# Altium schematic sheet VCU-S02-V00-12VProtection.SchDoc
size A4; SheetNumber: 6; SheetTotal: 9
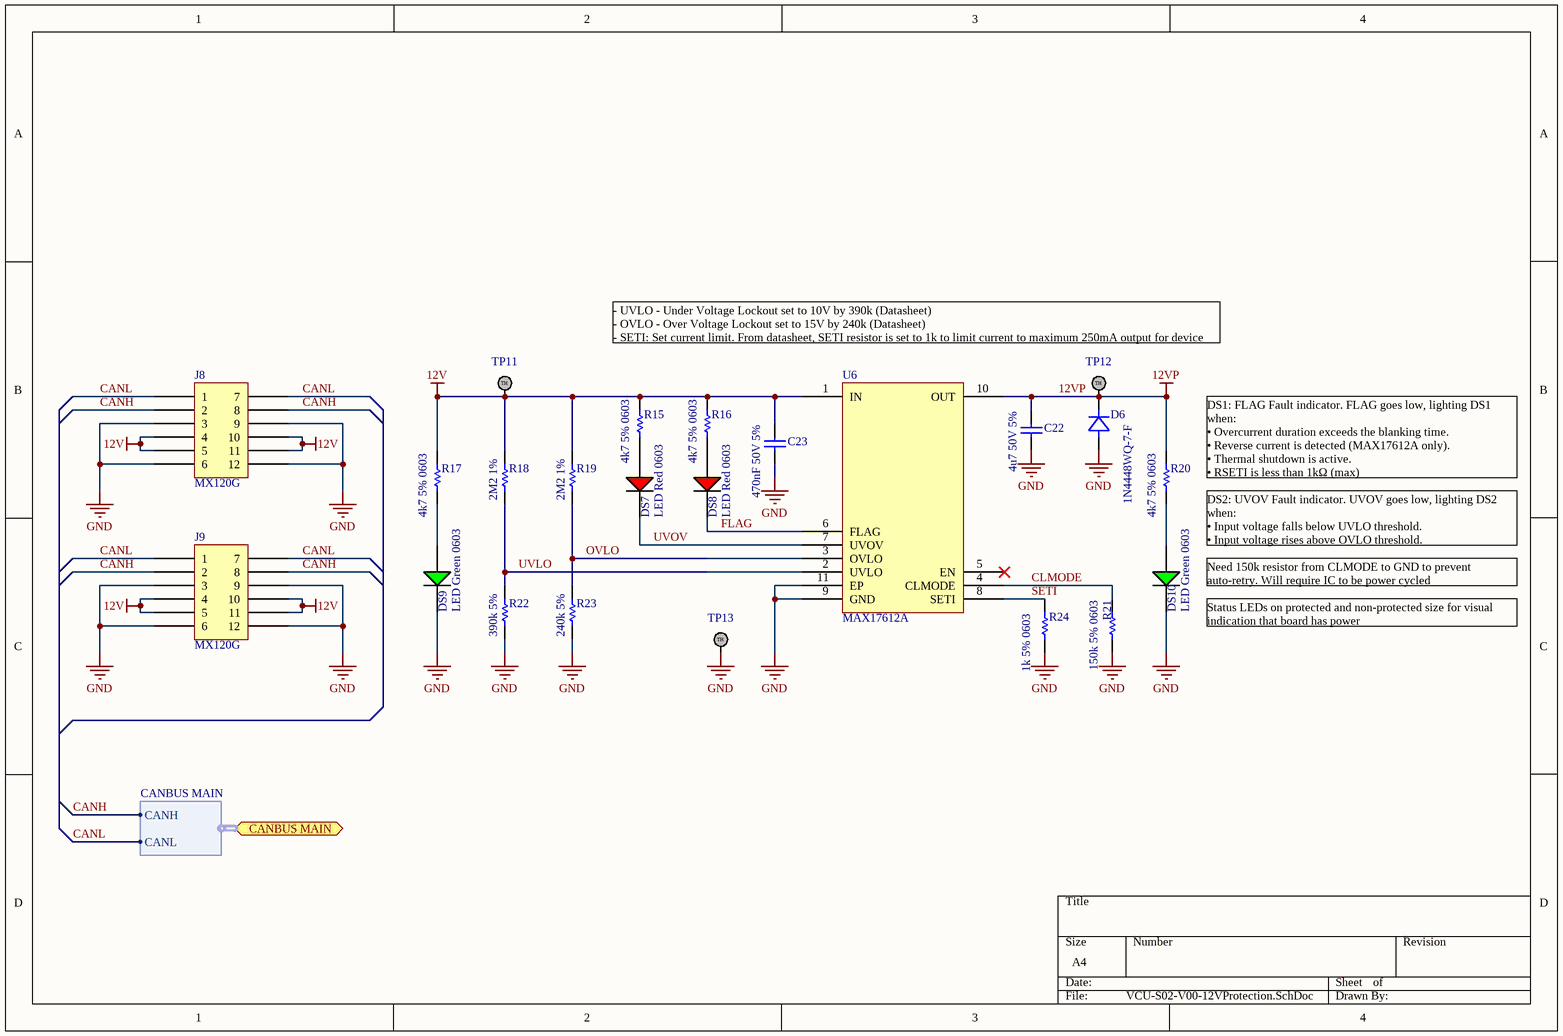
[diagram p0: VCU-S02-V00-12VProtection.SchDoc]

## Parts
C22  4u7 50V 5%  [Cap_Ceramic_0603]
C23  470nF 50V 5%  [Cap_Ceramic_0603]
D6  1N4448WQ-7-F  [SMA]
DS7  LED Red 0603  [LED RED 0603]
DS8  LED Red 0603  [LED RED 0603]
DS9  LED Green 0603  [LED GREEN 0603]
DS10  LED Green 0603  [LED GREEN 0603]
J8  MX120G  [MX120G]
J9  MX120G  [MX120G]
R15  4k7 5% 0603  [Res_ThinFilm_0603]
R16  4k7 5% 0603  [Res_ThinFilm_0603]
R17  4k7 5% 0603  [Res_ThinFilm_0603]
R18  2M2 1%  [Res_ThinFilm_0603]
R19  2M2 1%  [Res_ThinFilm_0603]
R20  4k7 5% 0603  [Res_ThinFilm_0603]
R21  150k 5% 0603  [Res_ThinFilm_0603]
R22  390k 5%  [Res_ThinFilm_0603]
R23  240k 5%  [Res_ThinFilm_0603]
R24  1k 5% 0603  [Res_ThinFilm_0603]
TP11  TestPoint  [TestPoint]  (value not drawn)
TP12  TestPoint  [TestPoint]  (value not drawn)
TP13  TestPoint  [TestPoint]  (value not drawn)
U6  MAX17612A  [10-Pin TDFN EP]

## Ports
CANBUS MAIN (bidir, harness CANBUS MAIN)

## Harnesses
CANBUS MAIN: CANH, CANL

## Nets
12V: C23.2 J8.4 J8.5 J8.10 J8.11 J9.4 J9.5 J9.10 J9.11 R15.2 R16.2 R17.2 R18.2 R19.2 TP11.1 U6.1(IN)
12VP: C22.2 D6.K(Cathode) R20.2 TP12.1 U6.10(OUT)
GND: C22.1 C23.1 D6.A(Anode) DS9.2(C) DS10.2(C) J8.3 J8.6 J8.9 J8.12 J9.3 J9.6 J9.9 J9.12 R21.1 R22.1 R23.1 R24.1 TP13.1 U6.9(GND) U6.11(EP)
CANH: J8.2 J8.8 J9.2 J9.8 ; port CANBUS MAIN.CANH
CANL: J8.1 J8.7 J9.1 J9.7 ; port CANBUS MAIN.CANL
CLMODE: R21.2 U6.4(CLMODE)
FLAG: DS8.2(C) U6.6(FLAG)
OVLO: R19.1 R23.2 U6.3(OVLO)
SETI: R24.2 U6.8(SETI)
UVLO: R18.1 R22.2 U6.2(UVLO)
UVOV: DS7.2(C) U6.7(UVOV)
NetDS7_1: DS7.1(A) R15.1
NetDS8_1: DS8.1(A) R16.1
NetDS9_1: DS9.1(A) R17.1
NetDS10_1: DS10.1(A) R20.1

Not connected (* = marked no-connect by the designer): U6 5(EN)*

## Notes on the sheet
- - UVLO - Under Voltage Lockout set to 10V by 390k (Datasheet)
  - OVLO - Over Voltage Lockout set to 15V by 240k (Datasheet)
  - SETI: Set current limit. From datasheet, SETI resistor is set to 1k to limit current to maximum 250mA output for device
- (near R20) DS1: FLAG Fault indicator. FLAG goes low, lighting DS1 when:
  • Overcurrent duration exceeds the blanking time.
  • Reverse current is detected (MAX17612A only).
  • Thermal shutdown is active.
  • RSETI is less than 1kΩ (max)
- DS2: UVOV Fault indicator. UVOV goes low, lighting DS2 when:
  • Input voltage falls below UVLO threshold.
  • Input voltage rises above OVLO threshold.
- (near DS10) Need 150k resistor from CLMODE to GND to prevent auto-retry. Will require IC to be power cycled
- (near DS10) Status LEDs on protected and non-protected size for visual indication that board has power
- (in symbol TestPoint) TH

## Library data of the parts
C22 = 4u7 50V 5% X7R 0603: Capacitor, Ceramic, SMD, 4u7, 50V, 5%, X7R, 0603
C23 = 470nF 50V 5% X7R 0603: Capacitor, Ceramic, SMD, 470nF, 50V, 5%, X7R, 0603
D6 = 1N4448WQ-7-F: Diode, SMD, 75V, 5%, 250mA, SOD123; Manufacturer: ON Semiconductor / Fairchild; Manufacturer Part Number: 1N914BWS; Average Rectified Current: 150mA; Element Configuration: Single; Forward Voltage: 1V; Max Reverse Leakage Current: 5uA; Power Dissipation: 200mW; Recovery Time: 4ns; Max Forward Surge Current (Ifsm): 4A; Parameter 1: *; Weight: 0.0276g; Category: Rectifier Diodes; Contact Plating: Tin,Matte; Forward Current: 150mA; Lead Free: Lead Free; Max Operating Temperature: 150°C; Max Repetitive Reverse Voltage (Vrrm): 75V; Max Reverse Voltage (DC): 75V; Min Operating Temperature: -55°C; Mount: Surface Mount; Number of Pins: 2; Package Quantity: 1; Packaging: Tape and Reel; Peak Reverse Current: 5uA; Radiation Hardening: No; REACH SVHC: No SVHC; Reverse Recovery Time: 4ns; Height: 1mm; Length: 1.8mm; Reverse Voltage: 75V; Width: 1.35mm
J8 J9 = MX120G: MX120G with standard connector layout
R15-R17 R20 = 4k7 5% 0603: Resistor, SMD, 4k7, 0.1W, 5%, 0603
R18 R19 = 2M2 1% 0603: Resistor, SMD, 2M2, 0.125W, 1%, 0603
R21 = 150k 5%, 0603: Resistor, SMD, 150k, 0.1W, 5%, 0603
R22 = 390k 5% 0603: Resistor, SMD, 390k, 0.1W, 5%, 0603
R23 = 240k 5% 0603: Resistor, SMD, 240k, 0.1W, 5%, 0603
R24 = 1k 5% 0603: Resistor, SMD, 1k, 0.1W, 5%, 0603
U6 = MAX17612A: 4.5V to 60V, 250mA Current-Limiter with OV, UV, and Reverse Protection; ComponentLink1Description: Datasheet; ComponentLink1URL: https://datasheets.maximintegrated.com/en/ds/MAX17612A-MAX17612C.pdf